# Altium schematic sheet Э3_5.SchDoc
size 420 x 297 mm; SheetNumber: 5; Scale: 1:1; DocumentType: Схема электрическая принципиальная
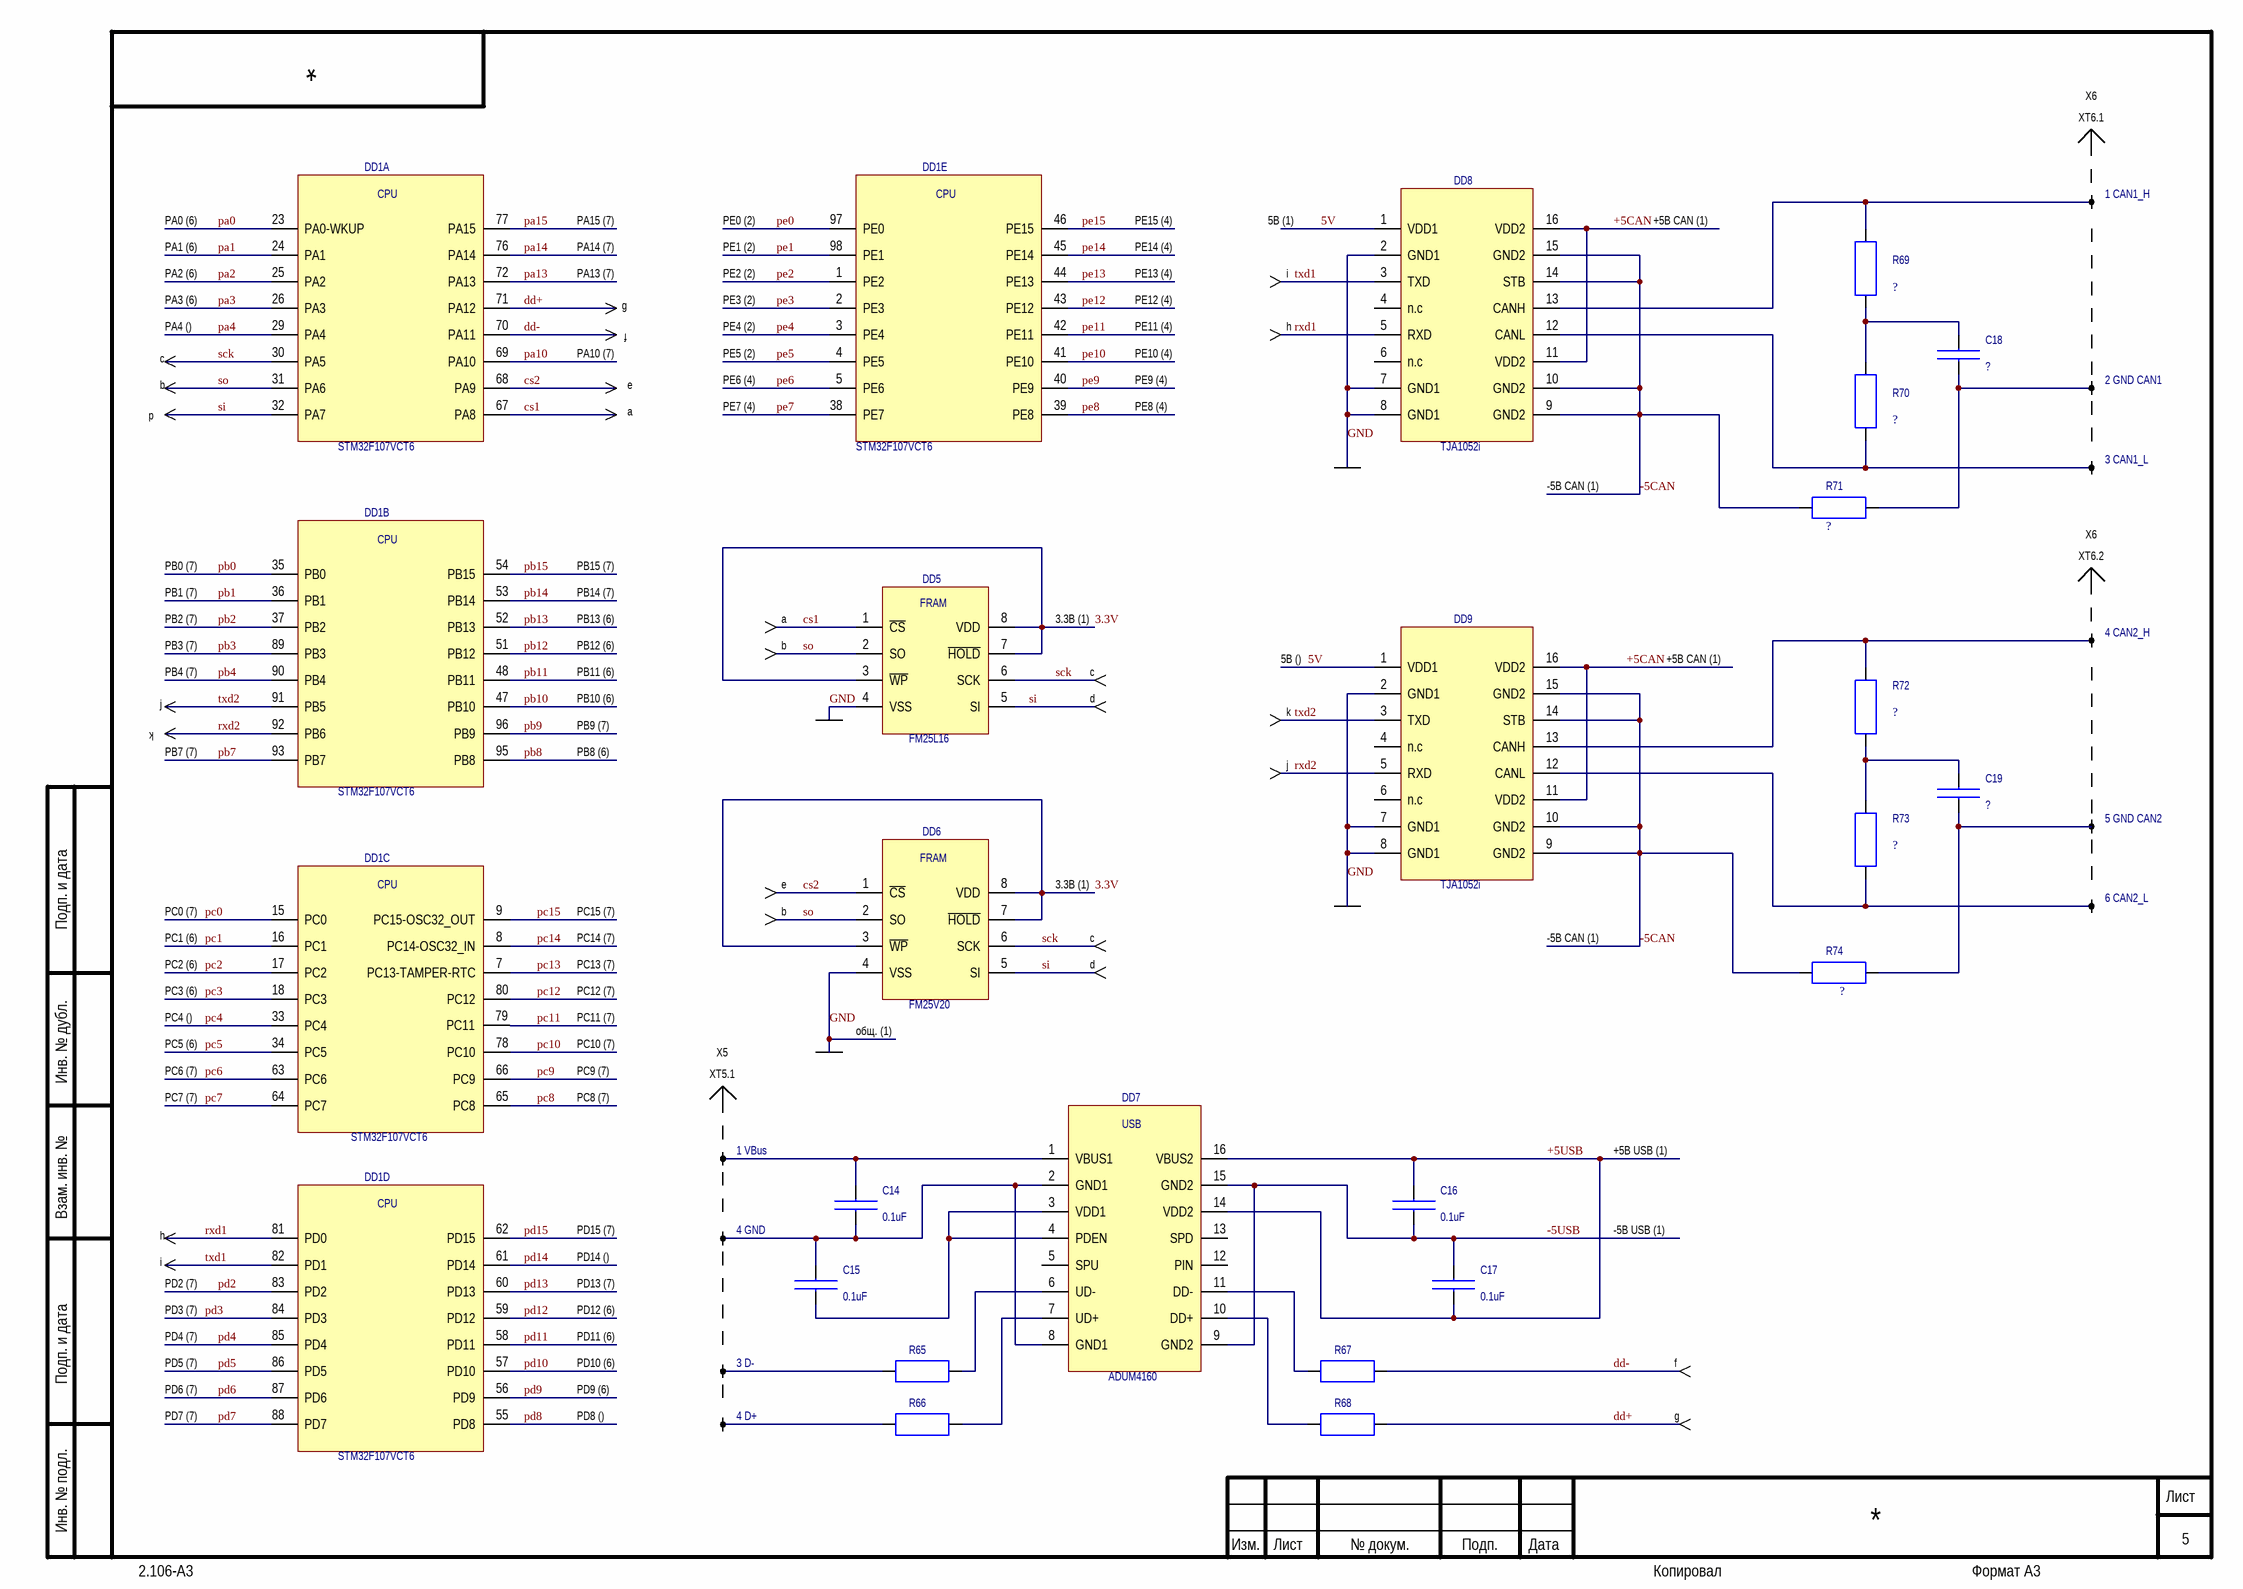
[diagram p0: Э3_5.SchDoc]

## Parts
C14  0.1uF  [CAP0805]
C15  0.1uF  [CAP0805]
C16  0.1uF  [CAP0805]
C17  0.1uF  [CAP0805]
C18  ?  [CAP0805]
C19  ?  [CAP0805]
DD1  STM32F107VCT6  [LQFP100_N]  (parts A,B,C,D,E of 6)
DD5  FM25L16  [SOIC127P600X175-8N]
DD6  FM25V20  [SOIC127P800X203-8N]
DD7  ADUM4160  [SOIC127P1030X265-16N]
DD8  TJA1052i  [SOP127P1030X265-16N]
DD9  TJA1052i  [SOP127P1030X265-16N]
R65  24  [RES0805]  (value not drawn)
R66  24  [RES0805]  (value not drawn)
R67  24  [RES0805]  (value not drawn)
R68  24  [RES0805]  (value not drawn)
R69  ?  [RES0805]
R70  ?  [RES0805]
R71  ?  [RES0805]
R72  ?  [RES0805]
R73  ?  [RES0805]
R74  ?  [RES0805]
X5  1 VBus  [usbB]  (parts A,B,C,D of 4)
X6  1 CAN1_H  [PLD10]  (parts A,B,C,D,E,F of 10)

## Nets
3.3V: DD5.3(~{WP}) DD5.7(~{HOLD}) DD5.8(VDD) DD6.3(~{WP}) DD6.7(~{HOLD}) DD6.8(VDD)
5V: DD8.1(VDD1) DD9.1(VDD1)
+5CAN: DD8.11(VDD2) DD8.16(VDD2) DD9.11(VDD2) DD9.16(VDD2)
+5USB: C16.2 C17.1 DD7.14(VDD2) DD7.16(VBUS2)
-5CAN: DD8.9(GND2) DD8.10(GND2) DD8.14(STB) DD8.15(GND2) DD9.9(GND2) DD9.10(GND2) DD9.14(STB) DD9.15(GND2) R71.2 R74.2
-5USB: C16.1 C17.2 DD7.9(GND2) DD7.15(GND2)
cs1: DD1.67(PA8) DD5.1(~{CS})
cs2: DD1.68(PA9) DD6.1(~{CS})
dd+: DD1.71(PA12) R68.1
dd-: DD1.70(PA11) R67.1
GND: DD5.4(VSS) DD6.4(VSS) DD8.2(GND1) DD8.7(GND1) DD8.8(GND1) DD9.2(GND1) DD9.7(GND1) DD9.8(GND1)
pa0: DD1.23(PA0-WKUP)
pa1: DD1.24(PA1)
pa2: DD1.25(PA2)
pa3: DD1.26(PA3)
pa4: DD1.29(PA4)
pa10: DD1.69(PA10)
pa13: DD1.72(PA13)
pa14: DD1.76(PA14)
pa15: DD1.77(PA15)
pb0: DD1.35(PB0)
pb1: DD1.36(PB1)
pb2: DD1.37(PB2)
pb3: DD1.89(PB3)
pb4: DD1.90(PB4)
pb7: DD1.93(PB7)
pb8: DD1.95(PB8)
pb9: DD1.96(PB9)
pb10: DD1.47(PB10)
pb11: DD1.48(PB11)
pb12: DD1.51(PB12)
pb13: DD1.52(PB13)
pb14: DD1.53(PB14)
pb15: DD1.54(PB15)
pc0: DD1.15(PC0)
pc1: DD1.16(PC1)
pc2: DD1.17(PC2)
pc3: DD1.18(PC3)
pc4: DD1.33(PC4)
pc5: DD1.34(PC5)
pc6: DD1.63(PC6)
pc7: DD1.64(PC7)
pc8: DD1.65(PC8)
pc9: DD1.66(PC9)
pc10: DD1.78(PC10)
pc12: DD1.80(PC12)
pc13: DD1.7(PC13-TAMPER-RTC)
pc14: DD1.8(PC14-OSC32_IN)
pc15: DD1.9(PC15-OSC32_OUT)
pd2: DD1.83(PD2)
pd3: DD1.84(PD3)
pd4: DD1.85(PD4)
pd5: DD1.86(PD5)
pd6: DD1.87(PD6)
pd7: DD1.88(PD7)
pd8: DD1.55(PD8)
pd9: DD1.56(PD9)
pd10: DD1.57(PD10)
pd11: DD1.58(PD11)
pd12: DD1.59(PD12)
pd13: DD1.60(PD13)
pd14: DD1.61(PD14)
pd15: DD1.62(PD15)
pe0: DD1.97(PE0)
pe1: DD1.98(PE1)
pe2: DD1.1(PE2)
pe3: DD1.2(PE3)
pe4: DD1.3(PE4)
pe5: DD1.4(PE5)
pe6: DD1.5(PE6)
pe7: DD1.38(PE7)
pe8: DD1.39(PE8)
pe9: DD1.40(PE9)
pe10: DD1.41(PE10)
pe11: DD1.42(PE11)
pe12: DD1.43(PE12)
pe13: DD1.44(PE13)
pe14: DD1.45(PE14)
pe15: DD1.46(PE15)
rxd1: DD1.81(PD0) DD8.5(RXD)
rxd2: DD1.92(PB6) DD9.5(RXD)
sck: DD1.30(PA5) DD5.6(SCK) DD6.6(SCK)
si: DD1.32(PA7) DD5.5(SI) DD6.5(SI)
so: DD1.31(PA6) DD5.2(SO) DD6.2(SO)
txd1: DD1.82(PD1) DD8.3(TXD)
txd2: DD1.91(PB5) DD9.3(TXD)
NetC14_1: C14.1 C15.2 DD7.2(GND1) DD7.8(GND1) X5.4
NetC14_2: C14.2 DD7.1(VBUS1) X5.1
NetC15_1: C15.1 DD7.3(VDD1) DD7.4(PDEN)
NetC18_1: C18.1 R71.1 X6.2
NetC18_2: C18.2 R69.1 R70.2
NetC19_1: C19.1 R74.1 X6.5
NetC19_2: C19.2 R72.1 R73.2
NetDD7_6: DD7.6(UD-) R65.2
NetDD7_7: DD7.7(UD+) R66.2
NetDD7_10: DD7.10(DD+) R68.2
NetDD7_11: DD7.11(DD-) R67.2
NetDD8_12: DD8.12(CANL) R70.1 X6.3
NetDD8_13: DD8.13(CANH) R69.2 X6.1
NetDD9_12: DD9.12(CANL) R73.1 X6.6
NetDD9_13: DD9.13(CANH) R72.2 X6.4
NetR65_1: R65.1 X5.3
NetR66_1: R66.1 X5.2

Not connected (* = marked no-connect by the designer): DD1 79(PC11); DD7 5(SPU) 12(PIN) 13(SPD); DD8 4(n.c) 6(n.c); DD9 4(n.c) 6(n.c)

## Notes on the sheet
- XT6.1
- X6
- PA0 (6)
- PA1 (6)
- PA14 (7)
- PA15 (7)
- PE0 (2)
- PE1 (2)
- PE14 (4)
- PE15 (4)
- 5В (1)
- +5В CAN (1)
- PA2 (6)
- PA3 (6)
- PA4 ()
- PA13 (7)
- g
- f
- PE2 (2)
- PE3 (2)
- PE4 (2)
- PE11 (4)
- PE12 (4)
- PE13 (4)
- i
- h
- b
- c
- PA10 (7)
- e
- PE5 (2)
- PE6 (4)
- PE9 (4)
- PE10 (4)
- d
- a
- PE7 (4)
- PE8 (4)
- -5В CAN (1)
- PB0 (7)
- PB1 (7)
- PB14 (7)
- PB15 (7)
- XT6.2
- PB2 (7)
- PB3 (7)
- PB12 (6)
- PB13 (6)
- 3.3В (1)
- 5В ()
- k
- j
- PB4 (7)
- PB9 (7)
- PB10 (6)
- PB11 (6)
- PB7 (7)
- PB8 (6)
- PС0 (7)
- PС15 (7)
- PС1 (6)
- PС2 (6)
- PС3 (6)
- PС12 (7)
- PС13 (7)
- PС14 (7)
- PС4 ()
- PС5 (6)
- PС10 (7)
- PС11 (7)
- XT5.1
- X5
- (near DD6) общ. (1)
- PС6 (7)
- PС7 (7)
- PС8 (7)
- PС9 (7)
- +5В USB (1)
- PD14 ()
- PD15 (7)
- -5В USB (1)
- PD2 (7)
- PD3 (7)
- PD4 (7)
- PD11 (6)
- PD12 (6)
- PD13 (7)
- PD5 (7)
- PD6 (7)
- PD9 (6)
- PD10 (6)
- PD7 (7)
- PD8 ()
- Подп. и дата
- Инв. № дубл.
- Взам. инв. №
- Инв. № подл.
- Изм.
- Лист
- № докум.
- Подп.
- Дата
- 2.106-A3
- Копировал
- Формат А3
- (in symbol ADUM4160) USB
- (in symbol FM25L16) FRAM
- (in symbol FM25V20) FRAM
- (in symbol STM32F107VCT6_1, part A) CPU
- (in symbol STM32F107VCT6_1, part B) CPU
- (in symbol STM32F107VCT6_1, part C) CPU
- (in symbol STM32F107VCT6_1, part D) CPU
- (in symbol STM32F107VCT6_1, part E) CPU

## Library data of the parts
C14-C19 = C
DD1 = STM32F107VCT6_1
R65-R74 = R
X5 = USBB-1J
X6 = PLD10